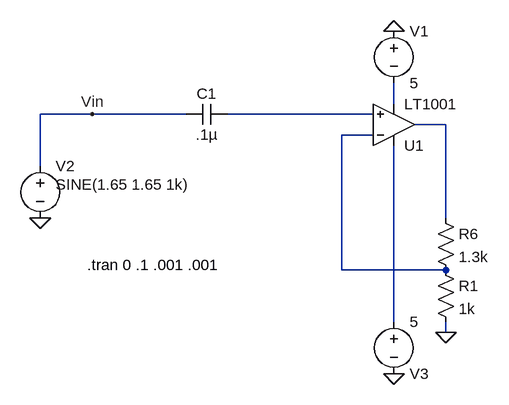
[diagram p0: schematic DAC amp.asc]
DAC amp.asc, the LTspice schematic file:
Version 4
SHEET 1 1300 768
WIRE 400 256 400 224
WIRE -64 272 -144 272
WIRE 80 272 -64 272
WIRE 368 272 144 272
WIRE 480 288 432 288
WIRE 368 304 320 304
WIRE -144 352 -144 272
WIRE 480 432 480 288
WIRE 320 512 320 304
WIRE 480 512 320 512
WIRE 400 592 400 320
WIRE 480 608 480 592
FLAG -144 432 0
FLAG -64 272 Vin
FLAG 400 672 0
FLAG 400 144 0
FLAG 480 608 0
SYMBOL voltage -144 336 R0
WINDOW 39 0 0 Left 2
WINDOW 123 24 44 Left 2
WINDOW 3 24 44 Left 2
SYMATTR Value SINE(1.65 1.65 1k)
SYMATTR InstName V2
SYMBOL cap 144 256 R90
WINDOW 0 0 32 VBottom 2
WINDOW 3 32 32 VTop 2
SYMATTR InstName C1
SYMATTR Value .1µ
SYMBOL voltage 400 576 R0
WINDOW 0 24 96 Left 2
WINDOW 3 24 16 Left 2
WINDOW 123 0 0 Left 2
WINDOW 39 0 0 Left 2
SYMATTR InstName V3
SYMATTR Value 5
SYMBOL res 464 416 R0
SYMATTR InstName R6
SYMATTR Value 1.3k
SYMBOL voltage 400 128 R0
WINDOW 123 0 0 Left 2
WINDOW 39 0 0 Left 2
SYMATTR InstName V1
SYMATTR Value 5
SYMBOL res 464 496 R0
SYMATTR InstName R1
SYMATTR Value 1k
SYMBOL Opamps\\LT1001 400 352 M180
SYMATTR InstName U1
TEXT -72 504 Left 2 !.tran 0 .1 .001 .001

The netlist it stands for:
* DAC amp.asc
V2 Vin 0 SINE(1.65 1.65 1k)
C1 N002 Vin .1µ
V3 N005 0 5
R6 N003 N004 1.3k
V1 0 N001 5
R1 N004 0 1k
XU1 N002 N004 N005 N001 N003 LT1001  ; pins In+ In- V+ V- OUT
.tran 0 .1 .001 .001
.lib LTC.lib
.backanno
.end